# EAGLE design TrinketProtoShield (EAGLE 7.7.0)
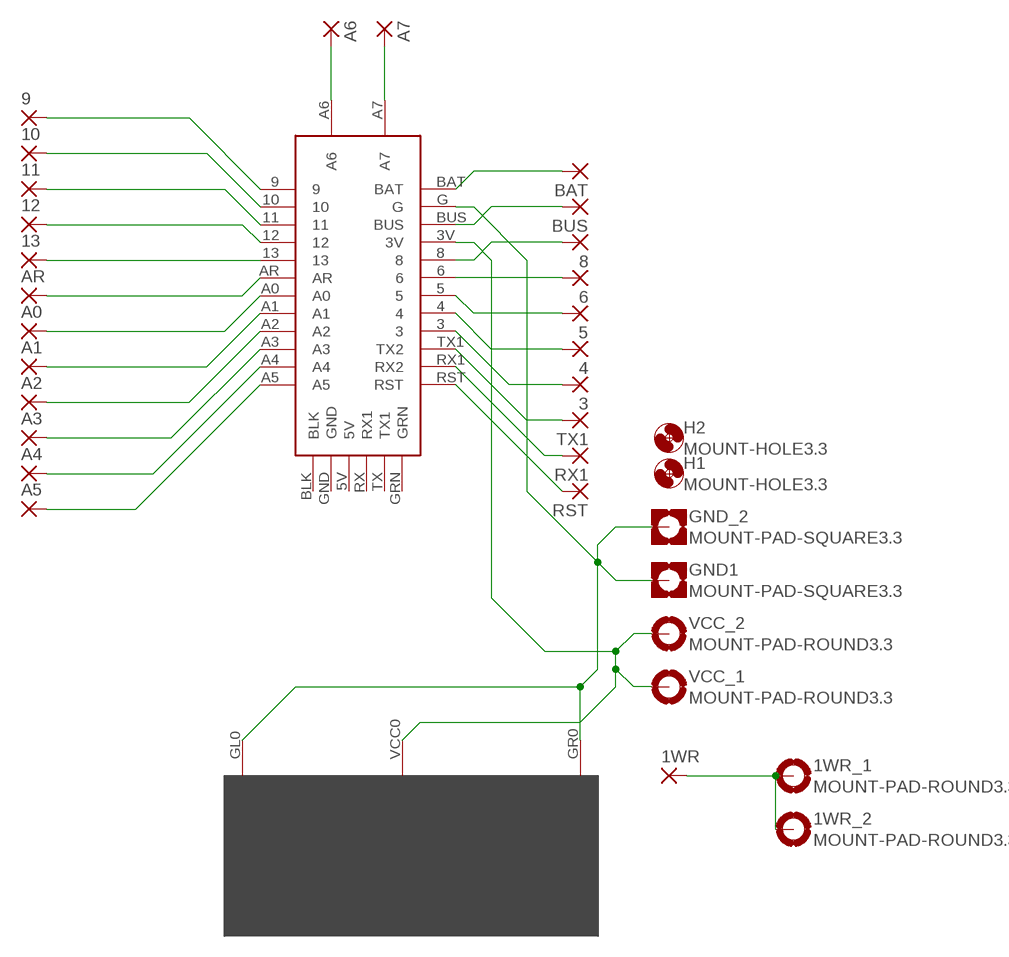
[diagram p0: schematic, sheet 1]

## Parts
1WR  1,6/0,9  [1,6/0,9]
1WR_1  MOUNT-PAD-ROUND3.3  [3,3-PAD]
1WR_2  MOUNT-PAD-ROUND3.3  [3,3-PAD]
3  1,6/0,9  [1,6/0,9]
4  1,6/0,9  [1,6/0,9]
5  1,6/0,9  [1,6/0,9]
6  1,6/0,9  [1,6/0,9]
8  1,6/0,9  [1,6/0,9]
9  1,6/0,9  [1,6/0,9]
10  1,6/0,9  [1,6/0,9]
11  1,6/0,9  [1,6/0,9]
12  1,6/0,9  [1,6/0,9]
13  1,6/0,9  [1,6/0,9]
A0  1,6/0,9  [1,6/0,9]
A1  1,6/0,9  [1,6/0,9]
A2  1,6/0,9  [1,6/0,9]
A3  1,6/0,9  [1,6/0,9]
A4  1,6/0,9  [1,6/0,9]
A5  1,6/0,9  [1,6/0,9]
A6  1,6/0,9  [1,6/0,9]
A7  1,6/0,9  [1,6/0,9]
AR  1,6/0,9  [1,6/0,9]
BAT  1,6/0,9  [1,6/0,9]
BUS  1,6/0,9  [1,6/0,9]
GND1  MOUNT-PAD-SQUARE3.3  [3,3-PAD-SQUARE]
GND_2  MOUNT-PAD-SQUARE3.3  [3,3-PAD-SQUARE]
H1  MOUNT-HOLE3.3  [3,3]
H2  MOUNT-HOLE3.3  [3,3]
RST  1,6/0,9  [1,6/0,9]
RX1  1,6/0,9  [1,6/0,9]
TX1  1,6/0,9  [1,6/0,9]
U$1  ARDUINO_PRO_TRINKET  [ARDUINO_PRO_TRINKET]
U$2  PROTOAREA  [PROTOAREA]
VCC_1  MOUNT-PAD-ROUND3.3  [3,3-PAD]
VCC_2  MOUNT-PAD-ROUND3.3  [3,3-PAD]

## Nets
N$1: 9.1(P) U$1.9
N$2: 10.1(P) U$1.10
N$3: 11.1(P) U$1.11
N$4: 12.1(P) U$1.12
N$5: 13.1(P) U$1.13
N$6: AR.1(P) U$1.AR
N$7: A0.1(P) U$1.A0
N$8: A1.1(P) U$1.A1
N$9: A2.1(P) U$1.A2
N$10: A3.1(P) U$1.A3
N$11: A4.1(P) U$1.A4
N$12: A5.1(P) U$1.A5
N$13: A6.1(P) U$1.A6
N$14: A7.1(P) U$1.A7
N$15: BAT.1(P) U$1.BAT
N$16: BUS.1(P) U$1.BUS
N$17: 8.1(P) U$1.8
N$18: 6.1(P) U$1.6
N$19: 1WR.1(P) 1WR_1.B3,3(MOUNT) 1WR_2.B3,3(MOUNT)
N$20: 5.1(P) U$1.5
N$21: 4.1(P) U$1.4
N$22: 3.1(P) U$1.3
N$23: TX1.1(P) U$1.TX1(TX2)
N$24: RX1.1(P) U$1.RX1(RX2)
N$25: RST.1(P) U$1.RST
N$28: GND1.B3,3(MOUNT) GND_2.B3,3(MOUNT) U$1.G U$2.GL0(RAIL1) U$2.GR0(RAIL3)
N$29: U$1.3V U$2.VCC0(RAIL2) VCC_1.B3,3(MOUNT) VCC_2.B3,3(MOUNT)
Unconnected: U$1.5V U$1.BLK U$1.GND U$1.GRN U$1.RX(RX1) U$1.TX(TX1)

## Library data of the parts
1WR 3-6 8-13 A0 A1-A7 AR BAT BUS RST RX1 TX1 = wirepad:1,6/0,9: THROUGH-HOLE PAD
1WR_1 1WR_2 VCC_1 VCC_2 = holes:MOUNT-PAD-ROUND: MOUNTING PAD, round
GND1 GND_2 = holes:MOUNT-PAD-SQUARE: MOUNTING PAD, square
H1 H2 = holes:MOUNT-HOLE: MOUNTING HOLE with drill center marker
U$1 = MetroMiniProtoshield:ARDUINO_PRO_TRINKET
U$2 = MetroMiniProtoshield:PROTOAREA

## Board
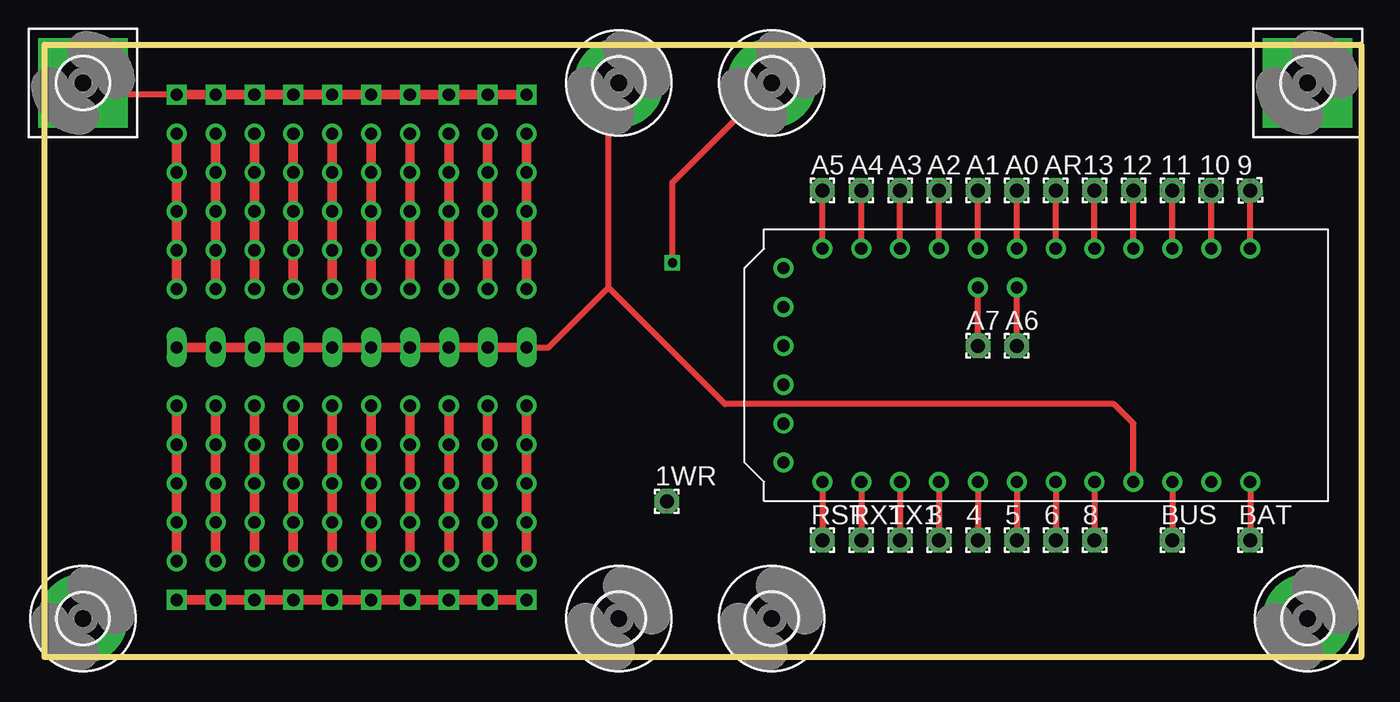
[diagram p1: board, top side]
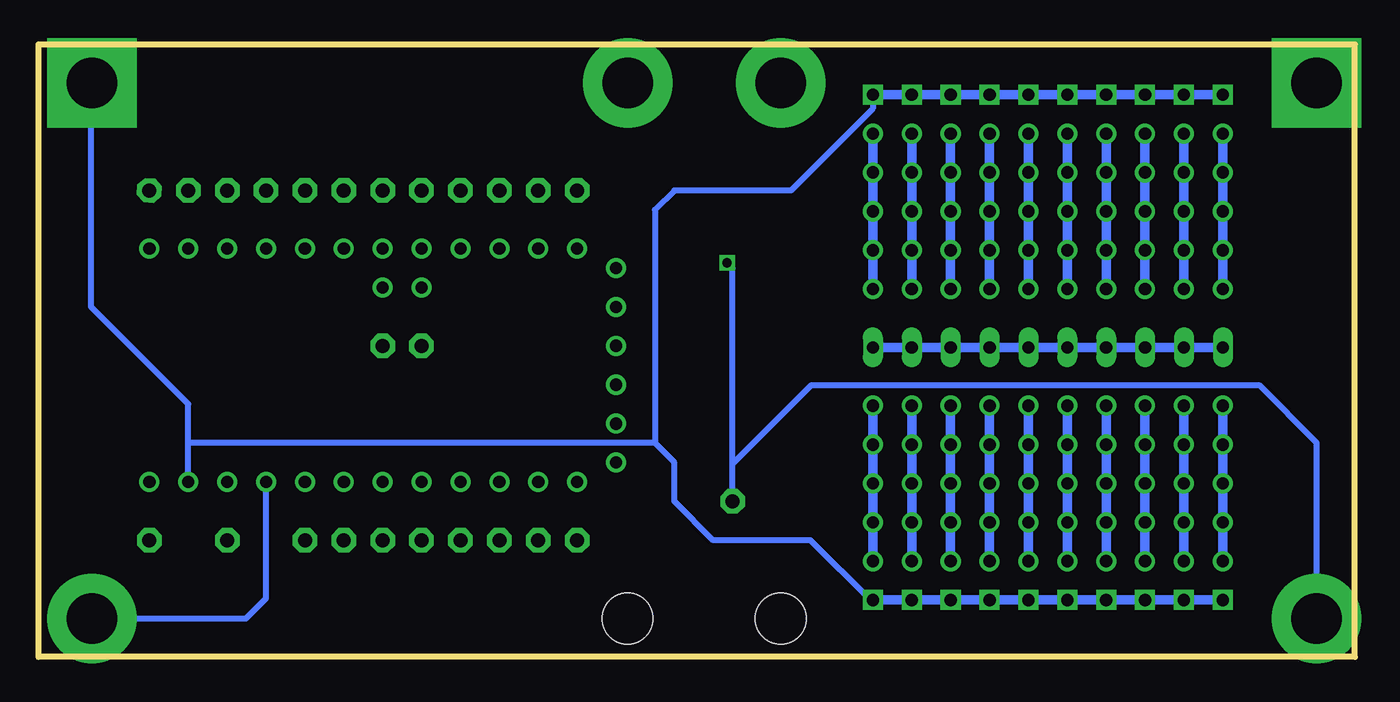
[diagram p2: board, bottom side, seen from below]

Size 86 x 40 mm. Coordinates in mm from the lower left corner, seen from the top.
Outline: 0,0 0,40 86,40 86,0 0,0
Copper layers (1*16): Top 0.035mm / dielectric 1.5mm / Bottom 0.035mm
Design rules "default": minimum track width 10mil, minimum drill 24mil, track to track 8mil, track to pad 8mil, pad to pad 8mil, via to via 8mil, smd to smd 8mil, copper to edge 40mil, drill to drill 8mil, minimum pad ring 10mil, minimum via ring 8mil, stop-mask expansion 4mil, vias tented up to drill 0mil, thermal gap 10mil

### Footprints (pad centres in the part's own frame; a part is rotated, then mirrored left to right if it is on the bottom)
1,6/0,9 = drill 0.914 pad 1.6 octagon: 1 0,0
3,3-PAD = drill 3.3 pad 5.842: B3,3 0,0
3,3-PAD-SQUARE = drill 3.3 pad 5.842 square: B3,3 0,0
3,3 = hole 3.3: 0,0
ARDUINO_PRO_TRINKET = drill 0.8: 3 7.62,-7.62; 3V 7.62,5.08; 4 7.62,-5.08; 5 7.62,-2.54; 5V -1.27,-17.78; 6 7.62,0; 8 7.62,2.54; 9 -7.62,12.7; 10 -7.62,10.16; 11 -7.62,7.62; 12 -7.62,5.08; 13 -7.62,2.54; A0 -7.62,-2.54; A1 -7.62,-5.08; A2 -7.62,-7.62; A3 -7.62,-10.16; A4 -7.62,-12.7; A5 -7.62,-15.24; A6 -5.08,-2.54; A7 -5.08,-5.08; AR -7.62,0; BAT 7.62,12.7; BLK -6.35,-17.78; BUS 7.62,7.62; G 7.62,10.16; GND -3.81,-17.78; GRN 6.35,-17.78; RST 7.62,-15.24; RX 1.27,-17.78; RX1 7.62,-12.7; TX 3.81,-17.78; TX1 7.62,-10.16
PROTOAREA = drill 0.8: A0 -1.27,-3.81; A1 -3.81,-3.81; A2 -6.35,-3.81; A3 -8.89,-3.81; A4 -11.43,-3.81; A5 -13.97,-3.81; A6 -16.51,-3.81; A7 -19.05,-3.81; A8 -21.59,-3.81; A9 -24.13,-3.81; B0 -1.27,-6.35; B1 -3.81,-6.35; B2 -6.35,-6.35; B3 -8.89,-6.35; B4 -11.43,-6.35; B5 -13.97,-6.35; B6 -16.51,-6.35; B7 -19.05,-6.35; B8 -21.59,-6.35; B9 -24.13,-6.35; C0 -1.27,-8.89; C1 -3.81,-8.89; C2 -6.35,-8.89; C3 -8.89,-8.89; C4 -11.43,-8.89; C5 -13.97,-8.89; C6 -16.51,-8.89; C7 -19.05,-8.89; C8 -21.59,-8.89; C9 -24.13,-8.89; D1 -3.81,-11.43; D2 -6.35,-11.43; D3 -8.89,-11.43; D4 -11.43,-11.43; D5 -13.97,-11.43; D6 -16.51,-11.43; D7 -19.05,-11.43; D8 -21.59,-11.43; D9 -24.13,-11.43; DO -1.27,-11.43; E1 -3.81,-13.97; E2 -6.35,-13.97; E3 -8.89,-13.97; E4 -11.43,-13.97; E5 -13.97,-13.97; E6 -16.51,-13.97; E7 -19.05,-13.97; E8 -21.59,-13.97; E9 -24.13,-13.97; EO -1.27,-13.97; F0 -1.27,-21.59; F1 -3.81,-21.59; F2 -6.35,-21.59; F3 -8.89,-21.59; F4 -11.43,-21.59; F5 -13.97,-21.59; F6 -16.51,-21.59; F7 -19.05,-21.59; F8 -21.59,-21.59; F9 -24.13,-21.59; G0 -1.27,-24.13; G1 -3.81,-24.13; G2 -6.35,-24.13; G3 -8.89,-24.13; G4 -11.43,-24.13; G5 -13.97,-24.13; G6 -16.51,-24.13; G7 -19.05,-24.13; G8 -21.59,-24.13; G9 -24.13,-24.13; H0 -1.27,-26.67; H1 -3.81,-26.67; H2 -6.35,-26.67; H3 -8.89,-26.67; H4 -11.43,-26.67; H5 -13.97,-26.67; H6 -16.51,-26.67; H7 -19.05,-26.67; H8 -21.59,-26.67; H9 -24.13,-26.67; I0 -1.27,-29.21; I1 -3.81,-29.21; I2 -6.35,-29.21; I3 -8.89,-29.21; I4 -11.43,-29.21; I5 -13.97,-29.21; I6 -16.51,-29.21; I7 -19.05,-29.21; I8 -21.59,-29.21; I9 -24.13,-29.21; J0 -1.27,-31.75; J1 -3.81,-31.75; J2 -6.35,-31.75; J3 -8.89,-31.75; J4 -11.43,-31.75; J5 -13.97,-31.75; J6 -16.51,-31.75; J7 -19.05,-31.75; J8 -21.59,-31.75; J9 -24.13,-31.75 | drill 0.8 square: GL0 -1.27,-1.27; GL1 -3.81,-1.27; GL2 -6.35,-1.27; GL3 -8.89,-1.27; GL4 -11.43,-1.27; GL5 -13.97,-1.27; GL6 -16.51,-1.27; GL7 -19.05,-1.27; GL8 -21.59,-1.27; GL9 -24.13,-1.27; GR0 -1.27,-34.29; GR1 -3.81,-34.29; GR2 -6.35,-34.29; GR3 -8.89,-34.29; GR4 -11.43,-34.29; GR5 -13.97,-34.29; GR6 -16.51,-34.29; GR7 -19.05,-34.29; GR8 -21.59,-34.29; GR9 -24.13,-34.29 | drill 0.8 long: VCC0 -1.27,-17.78; VCC1 -3.81,-17.78; VCC2 -6.35,-17.78; VCC3 -8.89,-17.78; VCC4 -11.43,-17.78; VCC5 -13.97,-17.78; VCC6 -16.51,-17.78; VCC7 -19.05,-17.78; VCC8 -21.59,-17.78; VCC9 -24.13,-17.78

### Placement (x,y rotation side)
1WR  40.64,10.16 0 top
1WR_1  47.5,37.5 0 top
1WR_2  2.5,2.5 0 top
3  58.42,7.62 0 top
4  60.96,7.62 0 top
5  63.5,7.62 0 top
6  66.04,7.62 0 top
8  68.58,7.62 0 top
9  78.74,30.48 3 top
10  76.2,30.48 0 top
11  73.66,30.48 0 top
12  71.12,30.48 0 top
13  68.58,30.48 0 top
A0  63.5,30.48 0 top
A1  60.96,30.48 0 top
A2  58.42,30.48 0 top
A3  55.88,30.48 0 top
A4  53.34,30.48 0 top
A5  50.8,30.48 0 top
A6  63.5,20.32 0 top
A7  60.96,20.32 0 top
AR  66.04,30.48 0 top
BAT  78.74,7.62 0 top
BUS  73.66,7.62 0 top
GND1  82.5,37.5 0 top
GND_2  2.5,37.5 0 top
H1  47.5,2.5 0 top
H2  37.5,2.5 0 top
RST  50.8,7.62 0 top
RX1  53.34,7.62 0 top
TX1  55.88,7.62 0 top
U$1  66.04,19.05 270 top
U$2  32.75,38 0 top
VCC_1  82.5,2.5 0 top
VCC_2  37.5,37.5 0 top

### Tracks (layer width: path | path; a pad name or v marks a point on that pad's centre or on a via)
N$1
  Top 0.406: U$1.9 9.1
N$2
  Top 0.406: U$1.10 10.1
N$3
  Top 0.406: U$1.11 11.1
N$4
  Top 0.406: U$1.12 12.1
N$5
  Top 0.406: U$1.13 13.1
N$6
  Top 0.406: U$1.AR AR.1
N$7
  Top 0.406: U$1.A0 A0.1
N$8
  Top 0.406: U$1.A1 A1.1
N$9
  Top 0.406: U$1.A2 A2.1
N$10
  Top 0.406: U$1.A3 A3.1
N$11
  Top 0.406: U$1.A4 A4.1
N$12
  Top 0.406: U$1.A5 A5.1
N$13
  Top 0.406: A6.1 U$1.A6
N$14
  Top 0.406: A7.1 U$1.A7
N$15
  Top 0.406: U$1.BAT BAT.1
N$16
  Top 0.406: U$1.BUS BUS.1
N$17
  Top 0.406: U$1.8 8.1
N$18
  Top 0.406: U$1.6 6.1
N$19  (via drill 0.6)
  Top 0.406: v41,25.75 41,31 1WR_1.B3,3
  Bottom 0.406: 1WR_2.B3,3 2.5,14 6.25,17.75 35.5,17.75 40.64,12.61 1WR.1 40.64,25.39 v41,25.75
N$20
  Top 0.406: U$1.5 5.1
N$21
  Top 0.406: U$1.4 4.1
N$22
  Top 0.406: U$1.3 3.1
N$23
  Top 0.406: U$1.TX1 TX1.1
N$24
  Top 0.406: U$1.RX1 RX1.1
N$25
  Top 0.406: U$1.RST RST.1
N$28
  Top 0.406: 8.62,36.73 3.27,36.73 GND_2.B3,3
  Bottom 0.406: U$1.G 76.2,13.97 | 76.2,13.97 76.2,16.51 82.55,22.86 82.55,37.45 GND1.B3,3 | U$2.GR0 31.65,3.71 35.56,7.62 41.91,7.62 44.45,10.16 44.45,12.7 45.72,13.97 | 45.72,13.97 76.2,13.97 | U$2.GL0 31.48,35.83 36.83,30.48 44.45,30.48 45.72,29.21 45.72,13.97
N$29
  Top 0.406: U$2.VCC0 32.92,20.22 36.83,24.13 | 36.83,24.13 36.83,36.83 VCC_2.B3,3 | U$1.3V 71.12,15.24 69.85,16.51 44.45,16.51 36.83,24.13
  Bottom 0.406: VCC_1.B3,3 72.43,2.5 71.12,3.81 U$1.3V